# EAGLE design Lora Node (EAGLE 9.6.2)
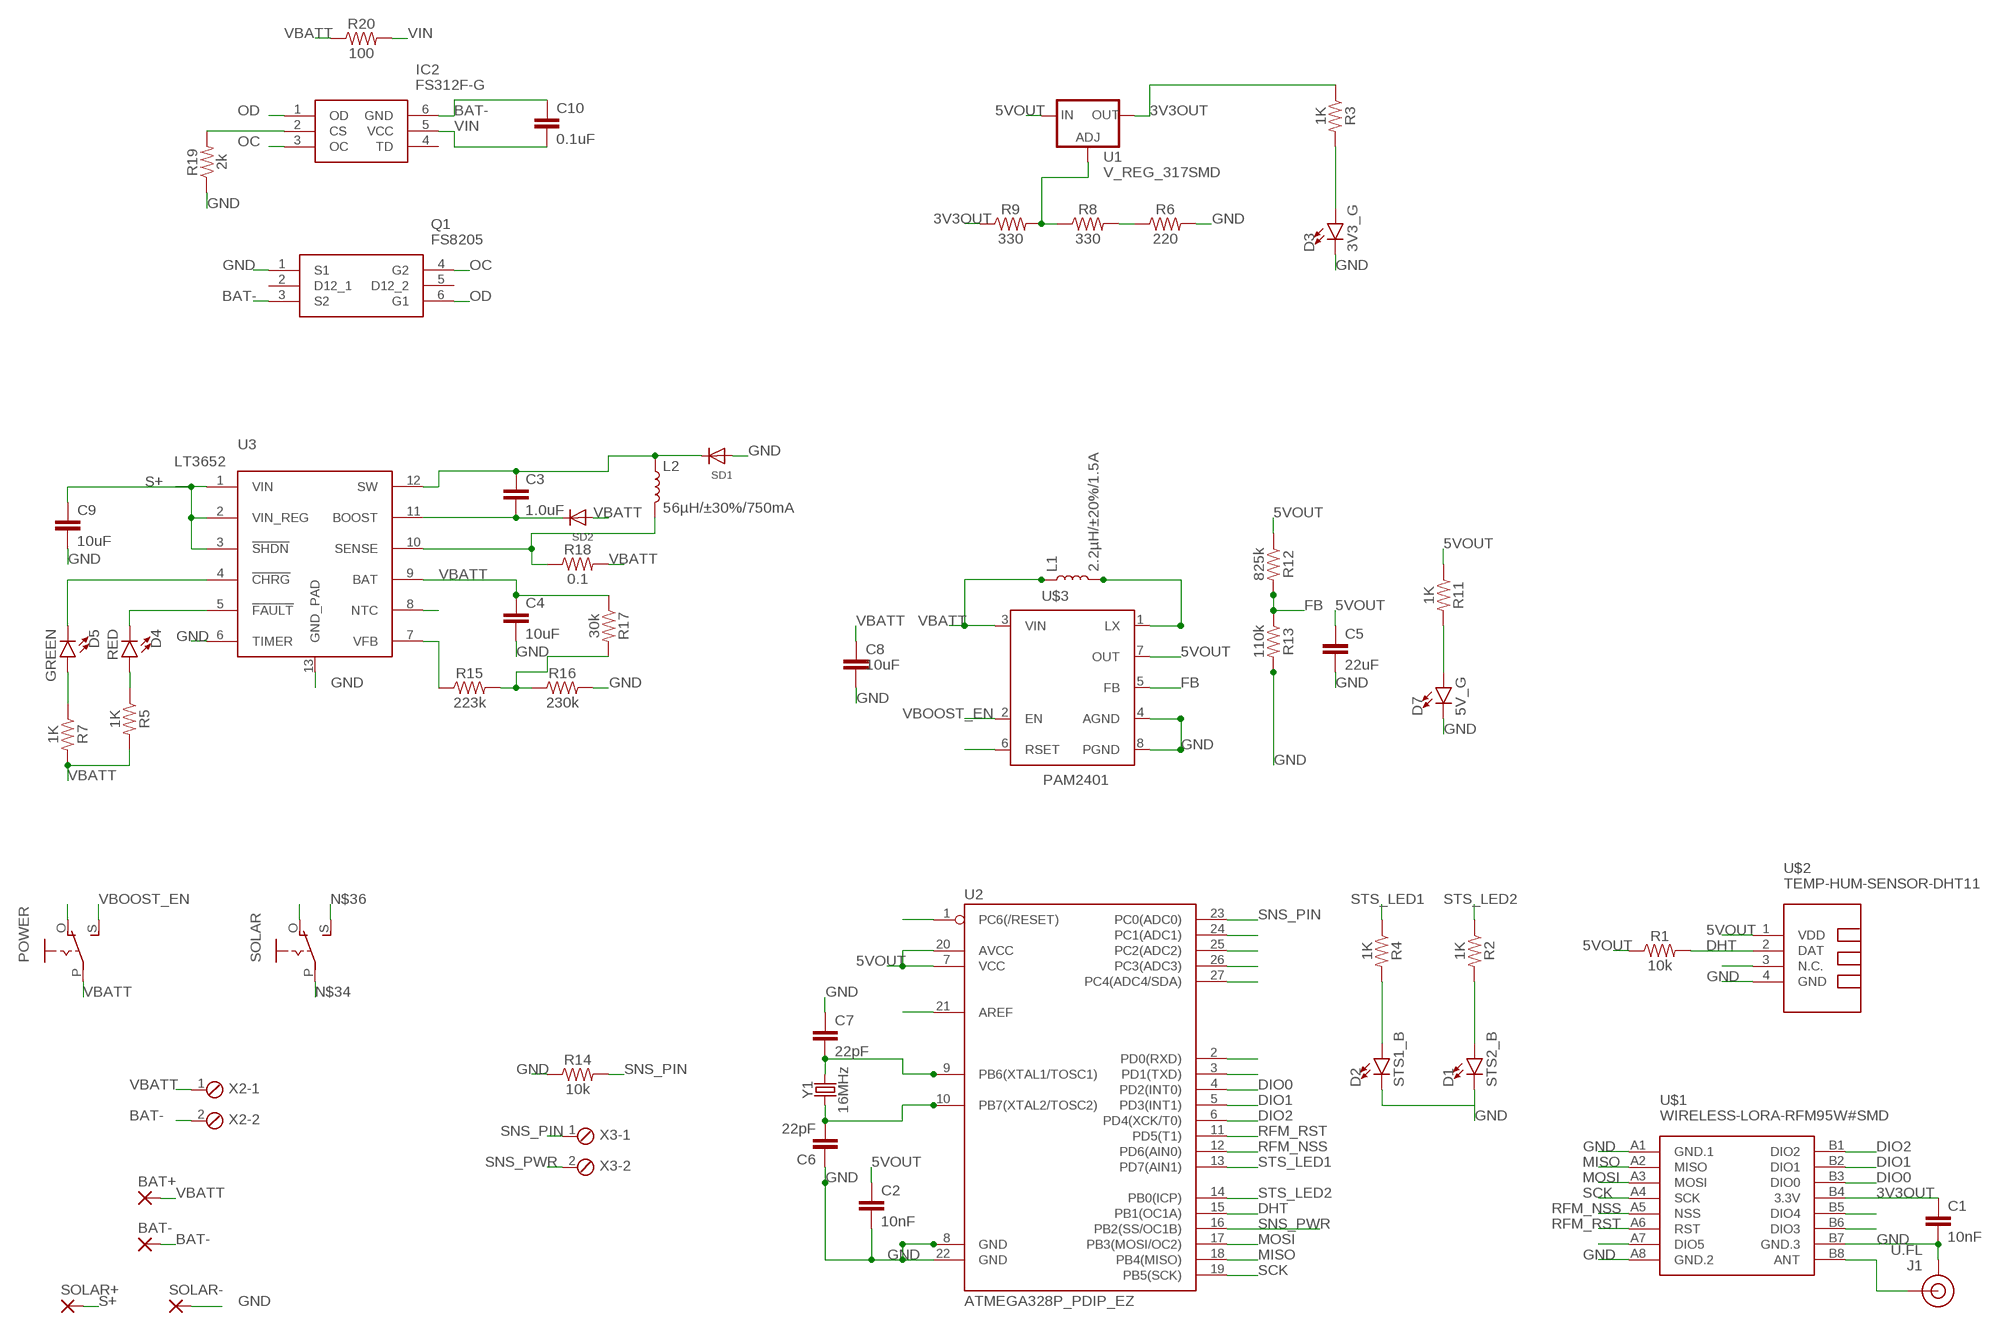
[diagram p0: schematic, sheet 1]

## Parts
BAT+  SMD5  [SMD2,54-5,08]
BAT-  SMD5  [SMD2,54-5,08]
C1  10nF  10NF-0603-50V-10%  [0603]
C2  10nF  10NF-0603-50V-10%  [0603]
C3  1.0uF  1.0UF-0805-25V-(+80/-20%)  [0805]
C4  10uF  10UF-0805-10V-10%  [0805]
C5  22uF  22UF-0805-6.3V-20%  [0805]
C6  22pF  22PF-0603-50V-5%  [0603]
C7  22pF  22PF-0603-50V-5%  [0603]
C8  10uF  10UF-0805-10V-10%  [0805]
C9  10uF  10UF-1210-50V-20%  [1210]
C10  0.1uF  0.1UF-0603-25V-5%  [0603]
D1  STS2_B  LED-BLUE1206  [LED-1206]
D2  STS1_B  LED-BLUE1206  [LED-1206]
D3  3V3_G  LED-GREEN0603  [LED-0603]
D4  RED  LED-RED0603  [LED-0603]
D5  GREEN  LED-GREEN0603  [LED-0603]
D7  5V_G  LED-GREEN0603  [LED-0603]
IC2  FS312F-G  [SOT95P280X145-6N]
J1  U.FL  U.FL2PIN  [U.FL]
L1  2.2µH/±20%/1.5A  INDUCTOR-VLF4012AT-2.2UH  [INDUCTOR_2.2UH]
L2  56µH/±30%/750mA  INDUCTOR-CR54-47UH  [CR54]
POWER  EG1218S  [EG1218]
Q1  FS8205  [FS8205]
R1  10k  10KOHM-0603-1/10W-1%  [0603]
R2  1K  220OHM-0603-1/10W-1%  [0603]
R3  1K  220OHM-0603-1/10W-1%  [0603]
R4  1K  220OHM-0603-1/10W-1%  [0603]
R5  1K  220OHM-0603-1/10W-1%  [0603]
R6  220  220OHM-0603-1/10W-1%  [0603]
R7  1K  220OHM-0603-1/10W-1%  [0603]
R8  330  330OHM-0603-1/10W-1%  [0603]
R9  330  330OHM-0603-1/10W-1%  [0603]
R11  1K  220OHM-0603-1/10W-1%  [0603]
R12  825k  820KOHM-0603-1/10W-1%  [0603]
R13  110k  100KOHM-0603-1/10W-1%  [0603]
R14  10k  10KOHM-0603-1/10W-1%  [0603]
R15  223k  220KOHM-0603-1/10W-1%  [0603]
R16  230k  220KOHM-0603-1/10W-1%  [0603]
R17  30k  30.1KOHM-0603-1/10W-1%  [0603]
R18  0.1  0.1OHM-1210-1/2W-1%  [1210]
R19  2k  220KOHM-0603-1/10W-1%  [0603]
R20  100  100OHM-0603-1/4W-5%  [0603]
SD1  DIODESMA  [SMADIODE]
SD2  DIODESMA  [SMADIODE]
SOLAR  EG1218S  [EG1218]
SOLAR+  SMD5  [SMD2,54-5,08]
SOLAR-  SMD5  [SMD2,54-5,08]
U1  V_REG_317SMD  [SOT223]
U2  ATMEGA328P_PDIP_EZ  [DIP28-SIMON-KIT]
U3  LT3652  [MSOP-12_GND]
U$1  WIRELESS-LORA-RFM95W#SMD  [WIRELESS-LORA-RFM95W#SMD]
U$2  TEMP-HUM-SENSOR-DHT11  [TEMP-HUM-SENSOR-DHT11]
U$3  PAM2401  [MSOP8]
X2  MPT2  [2POL254]
X3  MPT2  [2POL254]
Y1  16MHz  CRYSTAL-16MHZPTH-HC49US  [HC49US]

## Nets
3V3OUT: C1.1 R3.1 R9.1 U1.2(OUT) U$1.B4(3.3V)
5VOUT: C2.1 C5.1 R1.1 R11.1 R12.1 U1.3(IN) U2.7(VCC) U2.20(AVCC) U$2.1(VDD) U$3.7(OUT)
BAT-: BAT-.1(P) C10.1 IC2.6(GND) Q1.3(S2) X2.2
DHT: R1.2 U2.15(PB1(OC1A)) U$2.2(DAT)
DIO0: U2.4(PD2(INT0)) U$1.B3(DIO0)
DIO1: U2.5(PD3(INT1)) U$1.B2(DIO1)
DIO2: U2.6(PD4(XCK/T0)) U$1.B1(DIO2)
FB: R12.2 R13.1 U$3.5(FB)
GND: C1.2 C2.2 C4.2 C5.2 C6.1 C7.1 C8.2 C9.2 D1.C D2.C D3.C D7.C J1.1(GND) J1.2(GND) Q1.1(S1) R6.2 R13.2 R14.1 R16.2 R19.1 SD1.A SOLAR-.1(P) U2.8(GND) U2.22(GND) U3.6(TIMER) U3.13(GND_PAD) U$1.A1(GND.1) U$1.A8(GND.2) U$1.B7(GND.3) U$2.4(GND) U$3.4(AGND) U$3.8(PGND)
MISO: U2.18(PB4(MISO)) U$1.A2(MISO)
MOSI: U2.17(PB3(MOSI/OC2)) U$1.A3(MOSI)
N$1: C7.2 U2.9(PB6(XTAL1/TOSC1)) Y1.2
N$2: C6.2 U2.10(PB7(XTAL2/TOSC2)) Y1.1
N$3: D7.A R11.2
N$4: D5.A R7.1
N$5: U$2.3(N.C.)
N$6: U2.21(AREF)
N$7: D3.A R3.2
N$8: U2.24(PC1(ADC1))
N$9: U2.25(PC2(ADC2))
N$10: U2.26(PC3(ADC3))
N$11: U2.27(PC4(ADC4/SDA))
N$12: U2.2(PD0(RXD))
N$13: U2.3(PD1(TXD))
N$14: D2.A R4.2
N$15: D1.A R2.2
N$17: U2.1(PC6(/RESET))
N$18: D4.A R5.1
N$19: D5.C U3.4(!CHRG)
N$20: D4.C U3.5(!FAULT)
N$23: C3.1 L2.P$1 SD1.C U3.12(SW)
N$24: C3.2 SD2.C U3.11(BOOST)
N$25: IC2.2(CS) R19.2
N$26: L2.P$2 R18.1 U3.10(SENSE)
N$28: U3.8(NTC)
N$29: R15.1 U3.7(VFB)
N$30: R15.2 R16.1 R17.2
N$32: POWER.O
N$34: SOLAR.P
N$35: SOLAR.O
N$36: SOLAR.S
N$44: U$1.A7(DIO5)
N$50: U$1.B5(DIO4)
N$51: U$1.B6(DIO3)
N$53: J1.FEED(SIGNAL) U$1.B8(ANT)
N$54: R6.1 R8.2
N$56: U$3.6(RSET)
N$57: L1.P$2 U$3.1(LX)
N$59: R8.1 R9.2 U1.1(ADJ)
OC: IC2.3(OC) Q1.4(G2)
OD: IC2.1(OD) Q1.6(G1)
RFM_NSS: U2.12(PD6(AIN0)) U$1.A5(NSS)
RFM_RST: U2.11(PD5(T1)) U$1.A6(RST)
S+: C9.1 SOLAR+.1(P) U3.1(VIN) U3.2(VIN_REG) U3.3(!SHDN)
SCK: U2.19(PB5(SCK)) U$1.A4(SCK)
SNS_PIN: R14.2 U2.23(PC0(ADC0)) X3.1
SNS_PWR: U2.16(PB2(SS/OC1B)) X3.2
STS_LED1: R4.1 U2.13(PD7(AIN1))
STS_LED2: R2.1 U2.14(PB0(ICP))
VBATT: BAT+.1(P) C4.1 C8.1 L1.P$1 POWER.P R5.2 R7.2 R17.1 R18.2 R20.1 SD2.A U3.9(BAT) U$3.3(VIN) X2.1
VBOOST_EN: POWER.S U$3.2(EN)
VIN: C10.2 IC2.5(VCC) R20.2
Unconnected: IC2.4(TD) Q1.2(D12_1) Q1.5(D12_2)

## Library data of the parts
BAT+ BAT- SOLAR+ SOLAR- = wirepad:SMD5: SMD PAD
C1 C2 = SparkFun-Capacitors:10NF: 0.01uF/10nF/10,000pF ceramic capacitors A capacitor is a passive two-terminal electrical component used to store electrical energy temporarily in an electric field. CAP-09321; PROD_ID: CAP-00867
C3 = SparkFun-Capacitors:1.0UF: 1µF ceramic capacitors A capacitor is a passive two-terminal electrical component used to store electrical energy temporarily in an electric field.; PROD_ID: CAP-11625
C4 C8 = SparkFun-Capacitors:10UF: 10.0µF ceramic capacitors A capacitor is a passive two-terminal electrical component used to store electrical energy temporarily in an electric field.; PROD_ID: CAP-11330
C5 = SparkFun-Capacitors:22UF: 22µF ceramic capacitors A capacitor is a passive two-terminal electrical component used to store electrical energy temporarily in an electric field.; PROD_ID: CAP-08402
C6 C7 = SparkFun-Capacitors:22PF: 22pF ceramic capacitors A capacitor is a passive two-terminal electrical component used to store electrical energy temporarily in an electric field.; PROD_ID: CAP-07876
C9 = SparkFun-Capacitors:10UF: 10.0µF ceramic capacitors A capacitor is a passive two-terminal electrical component used to store electrical energy temporarily in an electric field.; PROD_ID: CAP-09824
C10 = SparkFun-Capacitors:0.1UF: 0.1µF ceramic capacitors A capacitor is a passive two-terminal electrical component used to store electrical energy temporarily in an electric field.; PROD_ID: CAP-08604
D1 D2 = SparkFun-LED:LED-BLUE: Blue SMD LED Used in manufacturing of various products at SparkFun Packages: 0603 - SMD 0603 package [Product Link] <http://www.digikey.com/product-detail/en/SMLE12BC7TT86/511-1589-2-ND/1641808> 1206 - SMD1206 package [Product Link] <http://www.digikey.com/product-detail/en/lite-on-inc/LTST-C150TBKT/160-1643-1-ND/573584> SparkFun Products: ESP8266 Thing-Dev Board <https://www.sparkfun.com/products/13711> RedBoard <https://www.sparkfun.com/products/12757>; PROD_ID: DIO-09911; VALUE: BLUE
D3 D7 = SparkFun-LED:LED-GREEN: Green SMD LED Used in manufacturing of various products at SparkFun Packages: 0603 - SMD 0603 package [Product Link] <http://www.futureelectronics.com/en/technologies/semiconductors/optoelectronics/leds/Pages/9894312-LTST-C190GKT.aspx?CrossPart=HSMG-C190&IM=0> LilyPad 1206 - SMD1206 LilyPad package [Product Link] <http://www.futureelectronics.com/en/Technologies/Product.aspx?ProductID=IN150NGHARVATEKCORPORATION2049943&IM=0> 1206 - SMD1206 package [Product Link] <http://www.futureelectronics.com/en/technologies/semiconductors/optoelectronics/leds/Pages/8315665-LTST-C150KGKT.aspx?IM=0> 1206 Bottom Mount -SMD 1206 Bottom Mount [Product Link] <http://www.digikey.com/product-detail/en/lite-on-inc/LTST-C230KGKT/160-1456-1-ND/386854> SparkFun Products: Pro Mini 328 -5V <https://www.sparkfun.com/products/821> RedBoard <https://www.sparkfun.com/products/12757> MP3 Trigger <https://www.sparkfun.com/products/13720> Makey Makey <https://www.sparkfun.com/products/11076>; PROD_ID: DIO-00821; VALUE: GREEN
D4 = SparkFun-LED:LED-RED: Red SMD LED Used in manufacturing of most products at SparkFun Packages: 0603 - SMD 0603 package [Product Link] <http://docs.avagotech.com/docs/AV02-0551EN> 0603 SMART - SMD 0603 SMART package ( more efficient and expensive)[Product Link] <http://www.osram-os.com/Graphics/XPic2/00077099_0.pdf> 1206 - SMD1206 package [Product Link] <https://www.sparkfun.com/datasheets/DevTools/LilyPad/Q150OVS4.pdff> SparkFun Products: Pro Mini 328 -5V <https://www.sparkfun.com/products/821> RedBoard <https://www.sparkfun.com/products/12757> IOIO-OTG <https://www.sparkfun.com/products/13613>; PROD_ID: DIO-00819
D5 = SparkFun-LED:LED-GREEN: Green SMD LED Used in manufacturing of various products at SparkFun Packages: 0603 - SMD 0603 package [Product Link] <http://www.futureelectronics.com/en/technologies/semiconductors/optoelectronics/leds/Pages/9894312-LTST-C190GKT.aspx?CrossPart=HSMG-C190&IM=0> LilyPad 1206 - SMD1206 LilyPad package [Product Link] <http://www.futureelectronics.com/en/Technologies/Product.aspx?ProductID=IN150NGHARVATEKCORPORATION2049943&IM=0> 1206 - SMD1206 package [Product Link] <http://www.futureelectronics.com/en/technologies/semiconductors/optoelectronics/leds/Pages/8315665-LTST-C150KGKT.aspx?IM=0> 1206 Bottom Mount -SMD 1206 Bottom Mount [Product Link] <http://www.digikey.com/product-detail/en/lite-on-inc/LTST-C230KGKT/160-1456-1-ND/386854> SparkFun Products: Pro Mini 328 -5V <https://www.sparkfun.com/products/821> RedBoard <https://www.sparkfun.com/products/12757> MP3 Trigger <https://www.sparkfun.com/products/13720> Makey Makey <https://www.sparkfun.com/products/11076>; PROD_ID: DIO-00821
IC2 = FS312F-G:FS312F-G: One Cell Lithium-ion/Polymer Battery Protection IC Source: Datasheet <https://www.ic-fortune.com/upload/Download/FS312F-G-DS-12_EN.pdf>; DESCRIPTION: One Cell Lithium-ion/Polymer Battery Protection IC; HEIGHT: 1.45mm; MANUFACTURER_NAME: Fortune Semiconductor Corporation; MANUFACTURER_PART_NUMBER: FS312F-G
J1 = SparkFun-Connectors:U.FL2PIN: SMD Antenna Connector - U.FL 2mm height, 3.0mm x 3.0mm receptacle size. SparkFun Products: SparkFun WiFi Shield - ESP8266 <https://www.sparkfun.com/products/13287> SparkFun ESP8266 Thing <https://www.sparkfun.com/products/13231> SparkFun MiniGen - Pro Mini Signal Generator Shield <https://www.sparkfun.com/products/11420>; PROD_ID: CONN-09193; SF_ID: WRL-09144
L1 = SparkFun-Coils:INDUCTOR: Inductors Resist changes in electrical current. Basically a coil of wire. SparkFun Products: SparkFun Load Cell Amplifier - HX711 <https://www.sparkfun.com/products/13879> IOIO-OTG - V2.2 <https://www.sparkfun.com/products/13613>; PROD_ID: NDUC-09513
L2 = SparkFun-Coils:INDUCTOR: Inductors Resist changes in electrical current. Basically a coil of wire. SparkFun Products: SparkFun Load Cell Amplifier - HX711 <https://www.sparkfun.com/products/13879> IOIO-OTG - V2.2 <https://www.sparkfun.com/products/13613>; PROD_ID: NDUC-10789; VALUE: 47µH/±30%/750mA
POWER SOLAR = adafruit:EG1218: SLIDING SWITCH 0.1" spacing through hole, vertical SPDT slide switch http://www.ladyada.net/library/pcb/eaglelibrary.html
Q1 = FS8205:FS8205: DUAL N-CHANNEL ENHANCEMENT MODE POWER MOFSET Source: Datasheet <https://www.ic-fortune.com/upload/Download/FS8205-DS-19_EN.pdf>; DESCRIPTION: DUAL N-CHANNEL ENHANCEMENT MODE POWER MOFSET; HEIGHT: 1mm; MANUFACTURER_NAME: Fortune Semiconductor Corporation; MANUFACTURER_PART_NUMBER: FS8205
R1 R14 = SparkFun-Resistors:10KOHM: 10kΩ resistor A resistor is a passive two-terminal electrical component that implements electrical resistance as a circuit element. Resistors act to reduce current flow, and, at the same time, act to lower voltage levels within circuits. - Wikipedia; PROD_ID: RES-00824
R2-R5 R7 R11 = SparkFun-Resistors:220OHM: 220Ω resistor A resistor is a passive two-terminal electrical component that implements electrical resistance as a circuit element. Resistors act to reduce current flow, and, at the same time, act to lower voltage levels within circuits. - Wikipedia; PROD_ID: RES-07861; VALUE: 220
R6 = SparkFun-Resistors:220OHM: 220Ω resistor A resistor is a passive two-terminal electrical component that implements electrical resistance as a circuit element. Resistors act to reduce current flow, and, at the same time, act to lower voltage levels within circuits. - Wikipedia; PROD_ID: RES-07861
R8 R9 = SparkFun-Resistors:330OHM: 330Ω resistor A resistor is a passive two-terminal electrical component that implements electrical resistance as a circuit element. Resistors act to reduce current flow, and, at the same time, act to lower voltage levels within circuits. - Wikipedia; PROD_ID: RES-00818
R12 = SparkFun-Resistors:820KOHM: 820kΩ resistor A resistor is a passive two-terminal electrical component that implements electrical resistance as a circuit element. Resistors act to reduce current flow, and, at the same time, act to lower voltage levels within circuits. - Wikipedia; PROD_ID: RES-13247; VALUE: 820k
R13 = SparkFun-Resistors:100KOHM: 100kΩ resistor A resistor is a passive two-terminal electrical component that implements electrical resistance as a circuit element. Resistors act to reduce current flow, and, at the same time, act to lower voltage levels within circuits. - Wikipedia; PROD_ID: RES-07828; VALUE: 100k
R15 R16 R19 = SparkFun-Resistors:220KOHM: 220kΩ resistor A resistor is a passive two-terminal electrical component that implements electrical resistance as a circuit element. Resistors act to reduce current flow, and, at the same time, act to lower voltage levels within circuits. - Wikipedia; PROD_ID: RES-08969; VALUE: 220k
R17 = SparkFun-Resistors:30.1KOHM: 30.1kΩ resistor A resistor is a passive two-terminal electrical component that implements electrical resistance as a circuit element. Resistors act to reduce current flow, and, at the same time, act to lower voltage levels within circuits. - Wikipedia; PROD_ID: RES-08595; VALUE: 30.1k
R18 = SparkFun-Resistors:0.1OHM: 0.1Ω resistor A resistor is a passive two-terminal electrical component that implements electrical resistance as a circuit element. Resistors act to reduce current flow, and, at the same time, act to lower voltage levels within circuits. - Wikipedia; PROD_ID: RES-12374
R20 = SparkFun-Resistors:100OHM: 100Ω resistor A resistor is a passive two-terminal electrical component that implements electrical resistance as a circuit element. Resistors act to reduce current flow, and, at the same time, act to lower voltage levels within circuits. - Wikipedia; PROD_ID: RES-12438
SD1 SD2 = adafruit:DIODE: Diode SMADIODE - SMA Surface Mount Package 20V 1A Schottky Diode Digikey: 641-1014-6-ND DO-1N4148 - Through Hole Small Current Diode SOD-123 20V 1 A (.5mV Vf) Schottky Diode - Digikey: MBRX120TPMSCT-ND SOD-323 10V 570mA (.38mV Vf, 3ns) Schottky Diode - Digikey: ZLLS410CT-ND SOD-523 30V 30mA Schottky Diode (RB751S-40TE61) - Digikey: RB751S-40TE61CT-ND SOT23-R/W - SOT23 Package (R = Solder Paste/Reflow Ovens, W = Hand-Soldering) BAT54Film 40V 300mA - Digikey: 497-7162-1-ND
U1 = SparkFun-IC-Power:V_REG_317: Voltage Regulator Standard LM317 adjustable voltage regulator. AOI (Adjust Output Input). Google 'LM317 Calculator' for easy to use app to get the two resistor values needed. 240/720 for 5V output. 240/390 for 3.3V output. Spark Fun Electronics SKU : COM-00527
U2 = SparkFun-IC-Microcontroller:ATMEGA328P_PDIP_EZ: Keyed ATMEGA328 DIP This is a version of the DIP package with pin 28 clipped to prevent reverse insertion. See regular 328 for product references.
U3 = SparkFun-IC-Power:LT3652: LT3652 MPPT Solar Charge Controller(IC-11822) 5V-32V smart charger for batteries up to 14.4V
U$1 = diy-modules:WIRELESS-LORA-RFM95W: 868/915 MHz LoRa Radio Transceiver Module based on SX1276 chip Click here to find device on ebay.com <http://www.ebay.com/sch/RFM95W+transceiver>
U$2 = diy-modules:TEMP-HUM-SENSOR-DHT11: DHT11 - digital humidity & temperature sensor DHT11 datasheet available here: https://akizukidenshi.com/download/ds/aosong/DHT11.pdf Click here to find device on ebay.com <http://www.ebay.com/sch/dht11+digital+sensor>
U$3 = SparkFun-IC-Power:PAM2401: PAM2401 - Boost PMIC Specifications: Up to 1A output current 0.9V to 4.75V Input Range 2.5V to 5.0V Adjustable Output Voltage Datasheet <https://www.diodes.com/assets/Datasheets/PAM2401.pdf> (Diodes inc.); PROD_ID: IC-XXXXX
X2 X3 = con-phoenix-254:MPT2: PHOENIX CONNECTOR; OC_FARNELL: unknown; OC_NEWARK: unknown
Y1 = SparkFun-Clocks:CRYSTAL-16MHZ: 16MHz Crystal Digikey Example <http://www.digikey.com/product-search/en?keywords=535-9122-1-ND> Frequency: 16MHz Frequency Stability: ±50ppm Frequency Tolerance: ±20ppm Load Capacitance: 18pF SparkFun Products: Pro Micro -5V/16MHz <https://www.sparkfun.com/products/12640> SparkFun Serial Enabled LCD Kit <https://www.sparkfun.com/products/10097>; PROD_ID: XTAL-08181; SF_ID: COM-00536

## Board
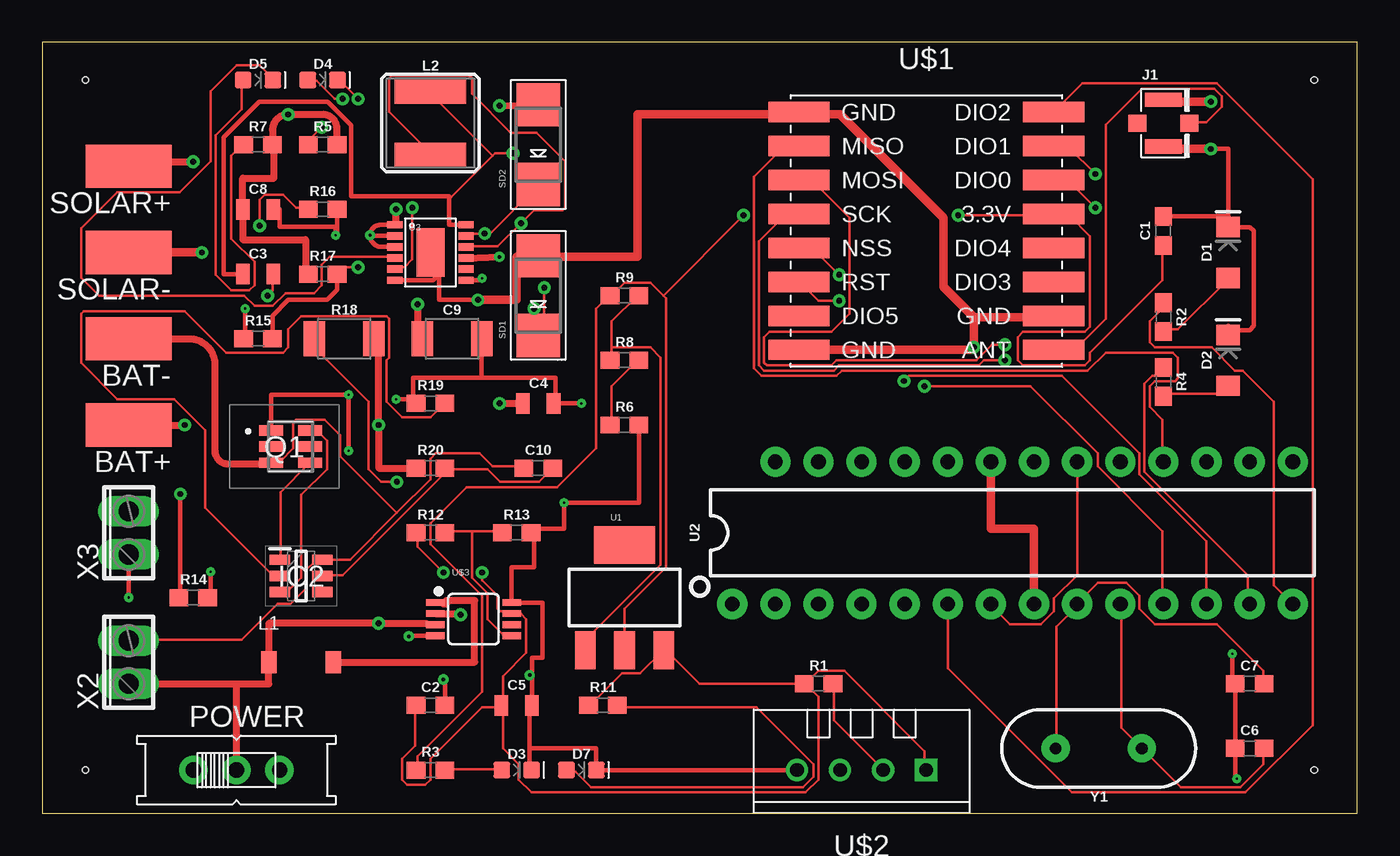
[diagram p1: board, top side]
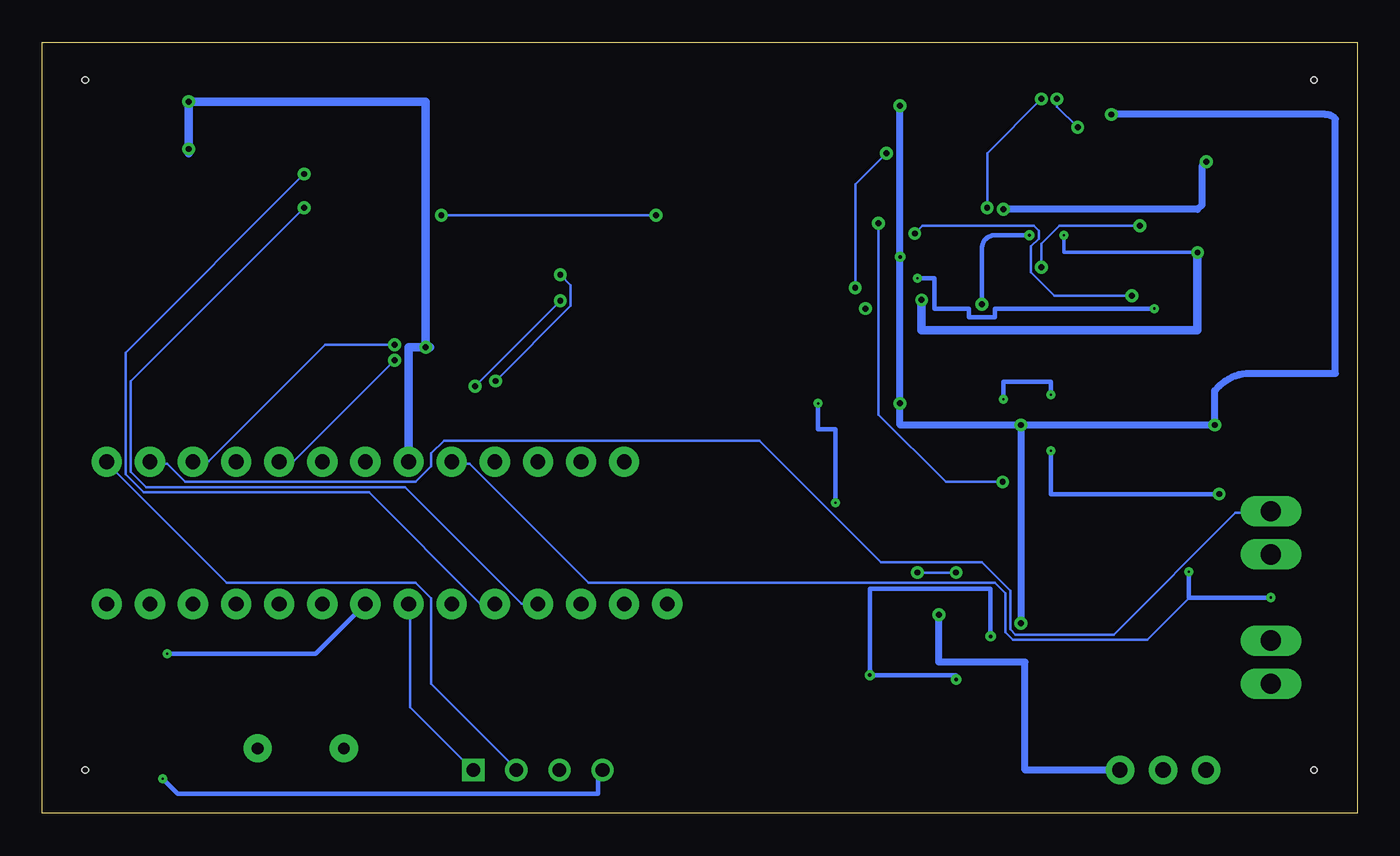
[diagram p2: board, bottom side, seen from below]

Size 77.45 x 45.39 mm. Coordinates in mm from the lower left corner, seen from the top.
Outline: 0,0 77.45,0 77.45,45.39 0,45.39 0,0
Copper layers (1*16): Top 0.035mm / dielectric 1.5mm / Bottom 0.035mm
Design rules "default": minimum track width 6mil, minimum drill 0.35mm, track to track 6mil, track to pad 6mil, pad to pad 6mil, via to via 6mil, smd to smd 6mil, copper to edge 40mil, drill to drill 6mil, minimum pad ring 10mil, minimum via ring 8mil, stop-mask expansion 4mil, vias tented up to drill 0mil, thermal gap 10mil
Holes 0.35 mm at 2.54,43.18 2.54,2.54 74.93,43.18 74.93,2.54

### Footprints (pad centres in the part's own frame; a part is rotated, then mirrored left to right if it is on the bottom)
SMD2,54-5,08 = smd 2.54 x 5.08: 1 0,0
0603 = smd 1.1 x 1: 1 -0.85,0; 2 0.85,0
0805 = smd 0.8 x 1.2: 1 -0.9,0; 2 0.9,0
1210 = smd 1.27 x 2.06: 1 -1.755,0; 2 1.755,0
LED-1206 = smd 1.2 x 1.4: A -1.5,0; C 1.5,0
LED-0603 = smd 1 x 1: A -0.877,0; C 0.877,0
SOT95P280X145-6N = smd 1.2 x 0.6: 1 -1.25,0.95; 2 -1.25,0; 3 -1.25,-0.95; 4 1.25,-0.95; 5 1.25,0; 6 1.25,0.95
U.FL = smd 2.2 x 0.85: 1 0,1.375; 2 0,-1.375 | smd 1.05 x 1: FEED 1.525,0; NC -1.525,0
INDUCTOR_2.2UH = smd 0.9 x 1.3: P$1 -1.9,0; P$2 1.9,0
CR54 = smd 4.2 x 1.4: P$1 0,1.85; P$2 0,-1.85
EG1218 = drill 0.9 pad 1.676: O -2.54,0; P 0,0; S 2.54,0
FS8205 = smd 1.4 x 0.6: 1 -0.5,0.95; 2 -0.5,0; 3 -0.5,-0.95; 4 1.8,0.95; 5 1.8,0; 6 1.8,-0.95
SMADIODE = smd 2.54 x 2.54: A 2.349,0; C -2.349,0
SOT223 = smd 1.219 x 2.235: 1 -2.311,-3.099; 2 0,-3.099; 3 2.311,-3.099 | smd 3.6 x 2.2: 4 0,3.099
DIP28-SIMON-KIT = drill 0.864 pad 1.778: 1 -16.51,-4.191; 2 -13.97,-4.191; 3 -11.43,-4.191; 4 -8.89,-4.191; 5 -6.35,-4.191; 6 -3.81,-4.191; 7 -1.27,-4.191; 8 1.27,-4.191; 9 3.81,-4.191; 10 6.35,-4.191; 11 8.89,-4.191; 12 11.43,-4.191; 13 13.97,-4.191; 14 16.51,-4.191; 15 16.51,4.191; 16 13.97,4.191; 17 11.43,4.191; 18 8.89,4.191; 19 6.35,4.191; 20 3.81,4.191; 21 1.27,4.191; 22 -1.27,4.191; 23 -3.81,4.191; 24 -6.35,4.191; 25 -8.89,4.191; 26 -11.43,4.191; 27 -13.97,4.191
MSOP-12_GND = smd 0.889 x 0.42: 1 -2.1,1.625; 2 -2.1,0.975; 3 -2.1,0.325; 4 -2.1,-0.325; 5 -2.1,-0.975; 6 -2.1,-1.625; 7 2.1,-1.625; 8 2.1,-0.975; 9 2.1,-0.325; 10 2.1,0.325; 11 2.1,0.975; 12 2.1,1.625 | smd 1.651 x 2.845: 13 0,0
WIRELESS-LORA-RFM95W#SMD = smd 3.6 x 1.2: A1 -7.5,7; A2 -7.5,5; A3 -7.5,3; A4 -7.5,1; A5 -7.5,-1; A6 -7.5,-3; A7 -7.5,-5; A8 -7.5,-7; B1 7.5,7; B2 7.5,5; B3 7.5,3; B4 7.5,1; B5 7.5,-1; B6 7.5,-3; B7 7.5,-5; B8 7.5,-7
TEMP-HUM-SENSOR-DHT11 = drill 0.8 square: 1 -3.81,0 | drill 0.8: 2 -1.27,0; 3 1.27,0; 4 3.81,0
MSOP8 = smd 0.4 x 1.1: 1 -0.975,-2.25; 2 -0.325,-2.25; 3 0.325,-2.25; 4 0.975,-2.25; 5 0.975,2.25; 6 0.325,2.25; 7 -0.325,2.25; 8 -0.975,2.25
2POL254 = drill 1.2 long: 1 -1.27,0; 2 1.27,0
HC49US = drill 0.7 pad 1.651: 1 -2.54,0; 2 2.54,0

### Placement (x,y rotation side)
BAT+  5.08,22.86 90 top
BAT-  5.08,27.94 90 top
C1  66.04,34.29 90 top
C2  22.86,6.35 0 top
C3  12.7,31.75 0 top
C4  29.21,24.13 0 top
C5  27.94,6.35 0 top
C6  71.12,3.81 0 top
C7  71.12,7.62 0 top
C8  12.7,35.56 0 top
C9  24.13,27.94 0 top
C10  29.21,20.32 0 top
D1  69.85,33.02 90 top
D2  69.85,26.67 90 top
D3  27.94,2.54 0 top
D4  16.51,43.18 0 top
D5  12.7,43.18 0 top
D7  31.75,2.54 0 top
IC2  15.24,13.97 0 top
J1  66.04,40.64 0 top
L1  15.24,8.89 0 top
L2  22.86,40.64 0 top
POWER  11.43,2.54 0 top
Q1  13.97,21.59 0 top
R1  45.72,7.62 0 top
R2  66.04,29.21 270 top
R3  22.86,2.54 0 top
R4  66.04,25.4 270 top
R5  16.51,39.37 0 top
R6  34.29,22.86 0 top
R7  12.7,39.37 0 top
R8  34.29,26.67 0 top
R9  34.29,30.48 0 top
R11  33.02,6.35 0 top
R12  22.86,16.51 0 top
R13  27.94,16.51 0 top
R14  8.89,12.7 0 top
R15  12.7,27.94 0 top
R16  16.51,35.56 0 top
R17  16.51,31.75 0 top
R18  17.78,27.94 0 top
R19  22.86,24.13 0 top
R20  22.86,20.32 0 top
SD1  29.21,30.48 90 top
SD2  29.21,39.37 90 top
SOLAR  6.35,-26.67 0 top  (outside the outline)
SOLAR+  5.08,38.1 90 top
SOLAR-  5.08,33.02 90 top
U1  34.29,12.7 0 top
U2  57.15,16.51 0 top
U3  22.86,33.02 0 top
U$1  52.07,34.29 0 top
U$2  48.26,2.54 180 top
U$3  25.4,11.43 270 top
X2  5.08,8.89 90 top
X3  5.08,16.51 90 top
Y1  62.23,3.81 180 top

### Tracks (layer width: path | path; a pad name or v marks a point on that pad's centre or on a via)
3V3OUT  (via drill 0.35)
  Top 0.152: C1.1 65.99,33.38 65.99,31.39 61.72,27.13 61.72,26.67 61.42,26.36 57.76,26.36 57.45,26.67 57.45,28.04 57.76,28.35 61.42,28.35 61.72,28.65 61.72,33.98 60.5,35.2 59.59,35.2 U$1.B4 59.44,35.2 v53.95,35.2 | R3.1 22.1,2.59 22.1,3.35 25.91,7.16 25.91,12.8 22.86,15.85 22.86,17.07 24.99,19.2 30.33,19.2 32.61,21.49 32.61,29.72 33.38,30.48 R9.1 33.53,30.48 34.29,31.24 35.81,31.24 36.58,30.48 | U1.2 34.29,12.04 36.73,14.48 36.73,30.33 36.58,30.48 | 36.58,30.48 v41.3,35.2
  Bottom 0.152: v41.3,35.2 v53.95,35.2
5VOUT  (via drill 0.35)
  Top 0.152: C2.1 21.95,6.25 21.95,3.96 21.18,3.2 21.18,1.98 21.49,1.68 22.55,1.68 22.86,1.98 22.86,3.2 25.91,6.25 26.98,6.25 C5.1 | C5.1 27.13,6.4 27.13,8.08 28.5,9.45 28.5,11.43 28.19,11.73 27.74,11.73 U$3.7 27.58,11.89 26.98,11.89 26.82,12.04 26.82,12.8 25.91,13.72 v25.91,14.17 | v23.62,14.17 22.1,15.7 22.1,16.46 R12.1 | R11.1 32.31,6.4 34.14,8.23 35.2,8.23 36.58,9.6 U1.3 36.73,9.6 38.71,7.62 R1.1 44.96,7.62 | 44.96,7.62 45.72,8.38 47.24,8.38 51.97,3.66 51.97,2.59 U$2.1 | U2.20 60.96,14.02 59.59,12.65 59.59,11.89 58.83,11.12 57,11.12 55.93,12.19 U2.7 | 44.96,7.62 45.72,6.86 45.72,1.98 44.96,1.22 28.8,1.22 28.04,1.98 28.04,2.9 27.13,3.81 27.13,6.25 C5.1
  Bottom 0.152: v25.91,14.17 v23.62,14.17 | U$2.1 55.78,6.25 55.78,12.19 U2.7
BAT-
  Top 0.152: 20.88,17.68 18.14,14.94 16.61,14.94 IC2.6 16.46,14.78 16,14.78 15.54,14.33 15.54,13.26 14.63,12.34 13.87,12.34 11.73,10.21 5.18,10.21 X2.2 | 20.88,17.68 22.86,19.66 22.86,20.88 23.16,21.18 25.76,21.18 26.52,20.42 28.35,20.42 C10.1 | 20.88,17.68 17.53,21.03 17.53,22.25 16.61,23.16 14.94,23.16 14.78,23.01 14.78,21.49 14.02,20.73 13.56,20.73 Q1.3
  Top 0.406: BAT-.1 8.64,27.94 arc-90 10.16,26.42 10.16,21.34 arc90 10.92,20.57 13.4,20.57 arc90 Q1.3
DHT
  Top 0.152: R1.2 46.63,7.62 46.63,5.49 49.53,2.59 U$2.2
  Bottom 0.152: U2.15 73.61,20.57 66.6,13.56 55.47,13.56 54.56,12.65 54.56,7.62 49.53,2.59 U$2.2
DIO0  (via drill 0.35)
  Top 0.152: v62.03,35.66 60.5,37.19 59.59,37.19 U$1.B3
  Bottom 0.152: v62.03,35.66 72.24,25.45 72.24,20.12 71.32,19.2 56.08,19.2 49.23,12.34 48.31,12.34 U2.4
DIO1  (via drill 0.35)
  Top 0.152: v62.03,37.64 60.5,39.17 59.59,39.17 U$1.B2
  Bottom 0.152: v62.03,37.64 72.54,27.13 72.54,19.96 71.48,18.9 58.22,18.9 51.66,12.34 50.9,12.34 U2.5
DIO2
  Top 0.152: U2.6 53.34,8.53 60.66,1.22 70.87,1.22 74.83,5.18 74.83,37.34 69.19,42.98 61.27,42.98 59.59,41.3 U$1.B1
FB
  Top 0.152: 25.3,16.61 26.98,16.61 R13.1 | 25.3,16.61 23.77,16.61 R12.2 | 25.3,16.61 25.3,13.87 26.21,12.95 26.21,11.43 27.13,10.52 27.58,10.52 U$3.5
GND  (via drill 0.13, 0.2, 0.35)
  Top 0.152: D2.C 69.95,28.19 70.1,28.35 70.1,28.45 | 28.84,8.08 28.8,8.08 v28.7,8.13 | SD1.A 29.26,32.92 29.26,32.77 | U3.13 22.86,32.31 23.32,31.85 23.37,31.75 | U$1.A1 44.65,41.3 44.65,41.15 | U$1.B7 59.44,29.26 58.52,29.26 58.42,29.21
  Top 0.254: v68.83,39.12 69.85,39.12 69.85,35.14 | 69.85,35.14 D1.C 71.14,34.52 71.37,34.29 71.37,28.7 71.12,28.45 70.1,28.45 69.85,28.7 | C1.2 69.85,35.14 | U$2.4 D7.C 32.63,3.81 28.7,3.81 | D3.C 28.7,2.54 28.7,3.81 | 28.7,3.81 28.7,6.35 C5.2 28.84,8.08 28.84,9.14 29.46,9.14 29.46,12.4 U$3.8 27.65,14.48 28.96,14.48 28.96,16.51 R13.2 28.79,16.76 30.73,16.76 v30.73,18.29 35.14,18.29 R6.2 | C2.2 23.71,7.87 v23.62,7.87 | v21.59,10.41 21.59,10.46 U$3.4 | v31.75,24.13 C4.2 30.23,24.13 30.23,25.65 25.89,25.65 | C9.2 25.89,25.65 | 25.89,25.65 21.84,25.65 21.84,24.38 | R19.1 21.84,24.13 21.84,24.38 | Q1.1 13.47,24.64 v18.03,24.64 v18.03,21.34 | v20.83,24.38 21.84,24.38 | v8.13,18.8 8.13,12.7 R14.1 | C8.2 13.97,35.56 13.97,34.54 17.27,34.54 v17.27,34.04 17.36,34.04 R16.2 | v25.65,30.23 23.37,30.23 23.37,31.75 23.01,31.39 U3.6 | v70.1,9.4 70.1,7.79 C7.1 C6.1 70.27,2.12 v70.36,2.03
  Top 0.508: SOLAR-.1 v9.4,33.02 | v25.65,30.23 27.94,30.23 27.94,32.77 29.26,32.77 35.05,32.77 35.05,41.15 44.65,41.15 46.99,41.15 53.09,35.05 53.09,30.99 54.86,29.21 | 54.86,29.21 58.42,29.21 | U$1.A8 54.86,27.29 v54.86,27.43 54.86,29.21 | U2.8 58.42,16.76 55.88,16.76 U2.22 | v68.83,39.12 66.04,39.12 J1.2 | v68.83,41.91 66.04,41.91 J1.1
  Bottom 0.203: v9.4,33.02 17.27,33.02 v17.27,34.04
  Bottom 0.254: v23.62,7.87 23.62,8.13 v28.7,8.13 28.7,13.21 21.59,13.21 v21.59,10.41 | v30.73,18.29 30.73,22.61 31.75,22.61 v31.75,24.13 | v18.03,24.64 18.03,25.4 20.83,25.4 v20.83,24.38 | v18.03,21.34 18.03,18.8 v8.13,18.8 | U2.8 61.34,9.4 v70.1,9.4 | U$2.4 44.7,2.29 44.7,1.14 69.47,1.14 v70.36,2.03
  Bottom 0.508: v9.4,33.02 9.4,28.45 25.65,28.45 v25.65,30.23 | U2.22 55.88,27.43 v54.86,27.43 | v54.86,27.43 54.61,27.43 | v54.86,27.43 54.86,41.91 v68.83,41.91 v68.83,39.12 68.83,38.86
MISO
  Top 0.152: U2.18 65.99,20.73 65.99,23.16 65.23,23.93 65.23,25.15 65.53,25.45 66.75,25.45 66.9,25.6 66.9,26.82 66.6,27.13 62.64,27.13 61.57,26.06 47.09,26.06 46.79,25.76 42.37,25.76 41.91,26.21 41.91,37.49 43.59,39.17 44.5,39.17 U$1.A2
MOSI  (via drill 0.35)
  Top 0.152: v56.69,27.58 55.93,27.58 55.02,26.67 46.79,26.67 46.48,26.36 42.67,26.36 42.52,26.52 42.52,28.04 42.82,28.35 46.48,28.35 47.55,29.41 47.55,35.05 45.41,37.19 44.65,37.19 U$1.A3
  Bottom 0.152: v56.69,27.58 60.81,27.58 67.67,20.73 68.58,20.73 U2.17
N$1
  Top 0.152: C7.2 71.93,7.62 71.93,8.38 69.19,11.12 65.53,11.12 64.62,12.04 64.62,12.8 63.86,13.56 62.18,13.56 60.96,12.34 U2.9 60.96,12.19 59.74,10.97 59.74,3.81 Y1.2
N$2
  Top 0.152: C6.2 71.93,3.81 71.93,2.9 70.56,1.52 67.06,1.52 Y1.1 63.55,5.03 63.55,12.19 U2.10
N$3
  Top 0.152: D7.A 30.94,2.44 31.39,2.44 32.31,1.52 44.81,1.52 45.41,2.13 45.41,2.9 42.06,6.25 33.98,6.25 R11.2
N$4
  Top 0.152: D5.A 11.73,43.13 11.73,41.45 10.21,39.93 10.21,31.7 11.12,30.79 12.19,30.79 12.5,31.09 12.5,32.46 11.12,33.83 11.12,38.71 11.73,39.32 R7.1
N$7
  Top 0.152: D3.A 26.98,2.59 23.77,2.59 R3.2
N$14
  Top 0.152: R4.2 66.14,24.69 69.34,24.69 69.8,25.15 D2.A
N$15
  Top 0.152: R2.2 66.14,28.5 66.9,28.5 69.8,31.39 D1.A
N$18  (via drill 0.35)
  Top 0.152: v17.68,42.06 17.22,42.06 16.15,43.13 15.7,43.13 D4.A | v16.46,40.39 15.54,39.47 R5.1
  Bottom 0.152: v17.68,42.06 17.68,41.6 v16.46,40.39
N$19
  Top 0.152: U3.4 20.73,32.77 16.92,32.77 16.46,32.31 16.46,31.09 16,30.63 14.33,30.63 13.56,29.87 12.5,29.87 11.89,30.48 3.35,30.48 2.29,31.55 2.29,34.44 4.42,36.58 8.08,36.58 9.91,38.41 9.91,42.52 11.43,44.04 12.8,44.04 13.56,43.28 D5.C
N$20  (via drill 0.35)
  Top 0.152: v21.79,35.66 21.79,32.61 21.34,32.16 20.88,32.16 U3.5 | v18.59,42.06 17.53,43.13 D4.C
  Bottom 0.152: v21.79,35.66 21.79,38.86 v18.59,42.06
N$21  (via drill 0.35)
  other vias: 28.96,29.72
N$23  (via drill 0.35)
  Top 0.152: v29.57,30.94 29.57,29.41 29.26,29.11 29.26,28.19 SD1.C | v27.74,38.86 26.67,38.86 26.52,38.71 | 26.52,38.71 24.08,36.27 23.96,36.27 | 26.52,38.71 22.86,42.37 L2.P$1
  Top 0.254: C3.1 10.67,31.75 10.67,39.8 12.78,41.91 16.79,41.91 18.19,40.51 18.19,36.34 23.96,36.34 23.96,36.27 23.96,34.65 U3.12
  Bottom 0.152: v29.57,30.94 29.57,37.03 v27.74,38.86
N$24  (via drill 0.35)
  Top 0.152: U3.11 24.99,34.14 v26.06,34.14 26.36,34.14 29.11,36.88 SD2.C | v13.26,30.48 13.56,30.79 13.56,31.7 C3.2
  Bottom 0.152: v13.26,30.48 17.83,30.48 19.2,31.85 19.2,33.38 18.75,33.83 18.75,34.29 19.05,34.59 25.6,34.59 v26.06,34.14
N$25
  Top 0.152: R19.2 23.62,24.08 22.86,23.32 21.18,23.32 20.27,24.23 20.27,26.67 20.42,26.82 20.42,29.11 20.27,29.26 15.24,29.26 14.48,28.5 14.48,27.43 14.17,27.13 10.82,27.13 8.38,29.57 2.44,29.57 2.29,29.41 2.29,26.52 4.42,24.38 7.77,24.38 9.6,22.55 9.6,17.98 13.56,14.02 13.87,14.02 IC2.2
N$26  (via drill 0.35)
  Top 0.152: U3.10 24.99,33.38 26.82,33.38 v28.19,34.75 28.96,35.51 30.63,35.51 30.79,35.66 30.79,38.41 29.11,40.08 27.58,40.08 25.3,42.37 25.3,43.28 25.15,43.43 20.57,43.43 20.42,43.28 20.42,41.3 22.86,38.86 L2.P$2 | v20.88,19.51 19.96,19.51 19.2,20.27 19.2,24.23 16.15,27.28 16.15,27.89 R18.1
  Bottom 0.152: v20.88,19.51 24.23,19.51 28.19,23.47 v28.19,34.75
N$29  (via drill 0.13)
  Top 0.254: R15.1 11.94,28.03 v11.94,29.72 | v25.91,31.5 25.91,31.39 U3.7
  Bottom 0.254: v11.94,29.72 21.34,29.72 21.34,29.21 22.86,29.21 22.86,29.72 24.89,29.72 24.89,31.5 v25.91,31.5
N$30  (via drill 0.35)
  Top 0.152: v12.8,34.59 12.8,36.12 13.11,36.42 14.17,36.42 14.94,35.66 15.54,35.66 R16.1 | v18.59,32.16 17.68,32.16 17.37,31.85 R17.2
  Top 0.254: R15.2 13.55,29.3 14.48,30.23 16.76,30.23 17.36,30.82 R17.2
  Bottom 0.152: v12.8,34.59 17.53,34.59 18.59,33.53 v18.59,32.16
N$53
  Top 0.152: J1.FEED 67.67,40.69 68.58,40.69 69.49,41.6 69.49,42.22 69.04,42.67 64.77,42.67 62.64,40.54 62.64,29.11 60.96,27.43 59.59,27.43 U$1.B8
N$54
  Top 0.152: R6.1 33.53,22.86 33.53,25.15 35.05,26.67 R8.2
N$57
  Top 0.152: U$3.1 23.16,12.34 23.47,12.34 23.62,12.31
  Top 0.406: 23.62,12.31 23.8,12.31 23.8,12.52 25.47,12.52 25.47,8.89 L1.P$2
N$59
  Top 0.152: 33.53,27.43 33.53,28.96 35.05,30.48 R9.2 | 33.53,27.43 33.53,26.67 R8.1 | 33.53,27.43 35.81,27.43 36.42,26.82 36.42,14.63 32,10.21 32,9.6 U1.1
OC
  Top 0.152: IC2.3 14.02,13.11 14.48,13.11 15.24,13.87 15.24,18.75 16.76,20.27 16.76,21.95 16.31,22.4 15.85,22.4 Q1.4
OD
  Top 0.152: IC2.1 14.02,14.94 14.02,18.9 15.7,20.57 Q1.6
RFM_NSS  (via drill 0.35)
  Top 0.152: U2.12 68.58,16 64.62,19.96 64.62,21.18 60.05,25.76 51.05,25.76 v50.75,25.45 | v46.94,31.7 45.41,33.22 44.65,33.22 U$1.A5
  Bottom 0.152: v50.75,25.45 46.33,29.87 46.33,31.09 v46.94,31.7
RFM_RST  (via drill 0.35)
  Top 0.152: v51.97,25.15 58.22,25.15 62.18,21.18 62.18,20.42 65.99,16.61 65.99,12.34 U2.11 | v46.94,30.18 45.72,30.18 44.65,31.24 U$1.A6
  Bottom 0.152: v46.94,30.18 v51.97,25.15
S+  (via drill 0.2, 0.35)
  Top 0.152: C9.1 22.25,28.04 22.25,28.65 22.1,28.7
  Top 0.254: U3.1 19.91,34.65 arc90 v19.3,34.04 | U3.3 20,33.34 arc-90 v19.3,34.04 | U3.2 19.34,33.99 arc-90 v19.3,34.04
  Top 0.406: SOLAR+.1 5.33,38.35 v8.89,38.35 | U3.1 20.83,34.71 v20.83,35.56 | v22.1,29.97 22.1,28.7
  Bottom 0.254: v19.3,34.04 21.34,34.04 arc-90 22.1,33.27 v22.1,29.97
  Bottom 0.406: v8.89,38.35 9.14,38.1 9.14,35.81 9.4,35.56 v20.83,35.56
SCK  (via drill 0.35)
  Top 0.152: v56.69,26.67 55.47,26.67 55.17,26.36 46.94,26.36 46.63,26.06 42.52,26.06 42.22,26.36 42.22,33.68 43.74,35.2 44.5,35.2 U$1.A4
  Bottom 0.152: v56.69,26.67 62.64,20.73 63.4,20.73 U2.19
SNS_PIN  (via drill 0.13)
  Top 0.254: X3.1 v5.08,12.7 | v9.91,14.22 9.91,12.7 R14.2
  Bottom 0.152: U2.23 53.34,20.57 52.27,20.57 45.26,13.56 21.34,13.56 20.73,12.95 20.73,10.67 20.27,10.21 12.34,10.21 9.91,12.65 9.91,12.7
  Bottom 0.254: v5.08,12.7 9.91,12.7 v9.91,14.22
SNS_PWR
  Bottom 0.152: U2.16 71.02,20.57 70.1,20.57 69.04,19.51 55.47,19.51 54.56,20.42 54.56,21.18 53.8,21.95 35.2,21.95 28.04,14.78 22.1,14.78 20.42,13.11 20.42,10.82 20.12,10.52 14.33,10.52 7.16,17.68 5.18,17.68 X3.2
STS_LED1
  Top 0.152: R4.1 65.99,26.21 65.53,25.76 65.38,25.76 64.92,25.3 64.92,20.12 71.02,14.02 71.02,12.34 U2.13
STS_LED2
  Top 0.152: R2.1 65.99,30.02 65.99,29.72 65.23,28.96 65.23,27.74 65.53,27.43 68.89,27.43 70.26,26.06 70.71,26.06 72.54,24.23 72.54,13.41 73.61,12.34 U2.14
VBATT  (via drill 0.2, 0.35)
  Top 0.152: U$3.3 23.01,11.12 22.71,11.12 22.61,11.18 | 19.81,27.43 19.81,27.58 19.51,27.89 R18.2
  Top 0.406: BAT+.1 v8.38,22.86 | 19.81,27.43 v19.81,22.86 19.81,20.32 R20.1 | v26.92,41.66 SD2.A | U3.9 v26.92,32.77 | R5.2 17.36,40.3 arc90 16.51,41.15 v14.48,41.15 arc90 13.55,40.22 R7.2 13.65,39.37 13.65,37.41 11.8,37.41 C8.1 11.8,33.78 15.49,33.78 15.49,31.75 R17.1 | v26.92,24.13 C4.1 | 22.61,11.18 v19.81,11.18 13.34,11.18 L1.P$1 13.34,7.62 11.43,7.62 | X2.1 11.43,7.62 | POWER.P 11.43,7.62
  Bottom 0.406: v19.81,22.86 v8.38,22.86 8.38,24.89 8.11,25.16 arc45 6.31,25.91 1.27,25.91 1.27,40.89 arc-45 1.88,41.15 v14.48,41.15 | v19.81,22.86 26.92,22.86 v26.92,24.13 v26.92,32.77 v26.92,41.66 | v19.81,22.86 v19.81,11.18
VBOOST_EN  (via drill 0.35)
  Top 0.406: U$3.2 24.64,11.76 v24.64,11.68
  Bottom 0.406: POWER.S 19.56,2.54 19.56,8.89 24.64,8.89 v24.64,11.68
VIN
  Top 0.152: 23.93,20.27 26.21,20.27 26.98,19.51 29.26,19.51 30.02,20.27 C10.2 | 23.93,20.27 23.77,20.27 R20.2 23.93,20.27 | 23.93,20.27 17.68,14.02 16.61,14.02 IC2.5